# Altium schematic sheet FPGA2.SchDoc: FPGA2
size A; Revision: 04
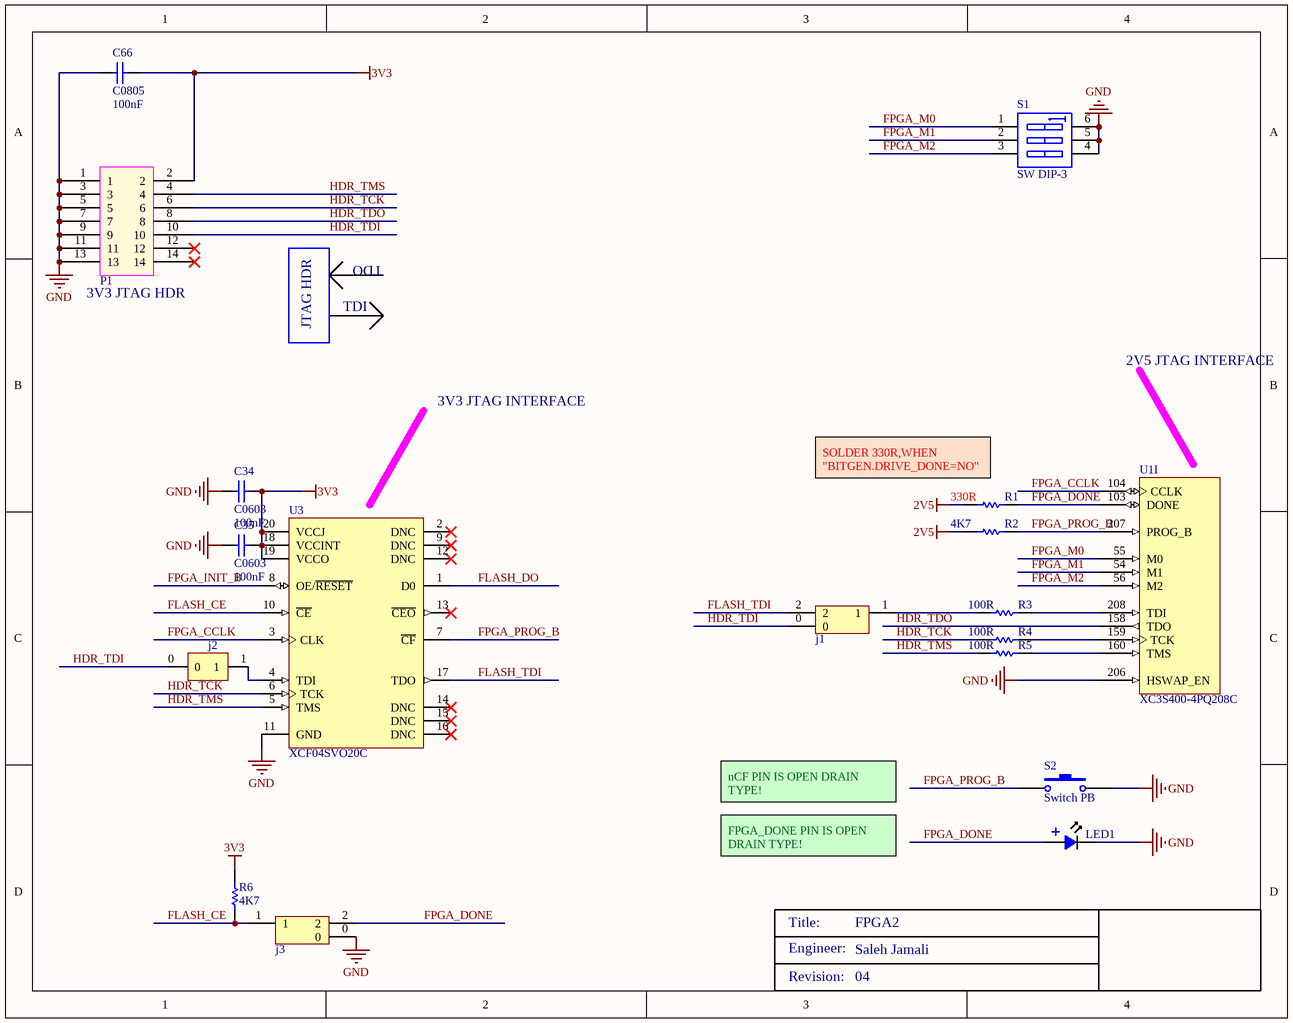
[diagram p0: FPGA2.SchDoc]

## Parts
C34  C0603  value 100nF  [0603]
C35  C0603  value 100nF  [0603]
C66  C0805  value 100nF  [0805]
j1  3pin  [3PIN]  (value not drawn)
j2  2pin  [2PIN]  (value not drawn)
j3  3pin  [3PIN]  (value not drawn)
LED1  LED_SMD  [LED_805]  (value not drawn)
P1  BoxHeader_14  [14p]  (value not drawn)
R1  330R  [ERA-0805]
R2  4K7  [ERA-0805]
R3  100R  [ERA-0805]
R4  100R  [ERA-0805]
R5  100R  [ERA-0805]
R6  4K7  [ERA-0805]
S1  SW DIP-3  [DIP-6]
S2  Switch PB  [Switch - Push to On]
U1  XC3S400-4PQ208C  [PQ208_N]  (part I of 11)
U3  XCF04SVO20C  [VO20_N]

## Nets
2V5: R1.1 R2.1
3V3: C34.1 C35.1 C66.2 P1.2 R6.2 U3.18(VCCINT) U3.19(VCCO) U3.20(VCCJ)
GND: C34.2 C35.2 C66.1 j3.0 LED1.2 P1.1 P1.3 P1.5 P1.7 P1.9 P1.11 P1.13 S1.4(B3) S1.5(B2) S1.6(B1) S2.2 U1.206(HSWAP_EN) U3.11(GND)
FLASH_CE: j3.1 R6.1 U3.10(~{CE})
FLASH_DO: U3.1(D0)
FLASH_TDI: j1.2 U3.17(TDO)
FPGA_CCLK: U1.104(CCLK) U3.3(CLK)
FPGA_DONE: j3.2 LED1.1 R1.2 U1.103(DONE)
FPGA_INIT_B: U3.8(OE/~{RESET})
FPGA_M0: S1.1(A1) U1.55(M0)
FPGA_M1: S1.2(A2) U1.54(M1)
FPGA_M2: S1.3(A3) U1.56(M2)
FPGA_PROG_B: R2.2 S2.1 U1.207(PROG_B) U3.7(~{CF})
HDR_TCK: P1.6 R4.1 U3.6(TCK)
HDR_TDI: j1.0 j2.0 P1.10
HDR_TDO: P1.8 U1.158(TDO)
HDR_TMS: P1.4 R5.1 U3.5(TMS)
Netj1_1: j1.1 R3.1
Netj2_1: j2.1 U3.4(TDI)
NetR3_2: R3.2 U1.208(TDI)
NetR4_2: R4.2 U1.159(TCK)
NetR5_2: R5.2 U1.160(TMS)

Not connected (* = marked no-connect by the designer): P1 12* 14*; U3 2(DNC)* 9(DNC)* 12(DNC)* 13(~{CEO})* 14(DNC)* 15(DNC)* 16(DNC)*

## Notes on the sheet
- (near P1) 3V3 JTAG HDR
- TDO
- JTAG HDR
- TDI
- 2V5 JTAG INTERFACE
- 3V3 JTAG INTERFACE
- (near R1) SOLDER 330R,WHEN "BITGEN.DRIVE_DONE=NO"
- (near U1) if HSWAP=GND then
  {
  pullup resistors Enabled
  }
- nCF PIN IS OPEN DRAIN TYPE!
- FPGA_DONE PIN IS OPEN DRAIN TYPE!
- Engineer:
- Title:
- Saleh Jamali
- Revision:

## Library data of the parts
C34 C35 = C0603: Ceramic Chip Capacitor - Standard; Note: Footprint corresponds to dimensions for bulk cassette packaging. This case size has tightened tolerances.; Published: 17-Jul-2002; LatestRevisionDate: 19-Mar-2004; LatestRevisionNote: Silkscreen size reduced.; DatasheetDocument: Mar-2001; PackageDocument: Mar-2001; PackageReference: 0603; Publisher: Altium Limited; Code_JEITA: 0603; Code_IPC: 1608 [0603]; ComponentLink1Description: Manufacturer Link; ComponentLink1URL: http://www.kemet.com/; ComponentLink2Description: Datasheet; ComponentLink2URL: http://www.kemet.com/kemet/web/homepage/kechome.nsf/vapubfilesname/F3102TA.pdf/$file/F3102TA.pdf
C66 = C0805: Ceramic Chip Capacitor - Standard; Note: Footprint corresponds to dimensions for bulk cassette packaging. This case size has tightened tolerances.; Published: 17-Jul-2002; LatestRevisionDate: 19-Mar-2004; LatestRevisionNote: Silkscreen size reduced.; DatasheetDocument: Mar-2001; PackageDocument: Mar-2001; PackageReference: 0805; Publisher: Altium Limited; Code_JEITA: 0805; Code_IPC: 2012[0805]; ComponentLink1Description: Manufacturer Link; ComponentLink1URL: http://www.kemet.com/; ComponentLink2Description: Datasheet; ComponentLink2URL: http://www.kemet.com/kemet/web/homepage/kechome.nsf/vapubfilesname/F3102TA.pdf/$file/F3102TA.pdf
R1-R6 = ERA6Y: Rectangular Thick Film Chip Resistor, 10 Ohm to 1M Ohm Range, 0.1% and 0.5% Tolerance, 0805 Size, 0.1 W; Note: If flow soldering, adjust pad width of PCB Footprint to 0.7 - 0.8 times the width of the resistor.; Published: 17-Dec-2003; LatestRevisionDate: 19-Mar-2004; LatestRevisionNote: Silkscreen size reduced.; PackageDocument: Mar-2003; PackageReference: ERA-0805; Publisher: Altium Limited; Code_IPC: 2012 [0805]; ComponentLink1Description: Manufacturer Link; ComponentLink1URL: http://www.panasonic.com/industrial/components/resistive_products.htm; ComponentLink2Description: Datasheet; ComponentLink2URL: http://www.panasonic.com/industrial/components/pdf/AOA0000CE8.pdf
S1 = SW DIP-3: DIP Switch, 3 Position, SPST; Published: 24-Mar-1999; LatestRevisionDate: 17-Jul-2002; LatestRevisionNote: Re-released for DXP Platform.; PackageReference: DIP-6; Publisher: Altium Limited; Code_JEDEC: MO-001-AM
S2 = Switch PB: Push Button Switch
U1 = XC3S400-4PQ208C: Spartan-3 1.2V FPGA, 141 User I/Os, 208-Pin PQFP, Standard Performance, Commercial Grade; OrderingInformation: Additional code may have to be appended for different mask revision devices.; DatasheetVersion: ver2.5, Dec-2009; PackageVersion: ver1.2, Jun-2004; PackageReference: PQ208; PackageDescription: 208-Pin Plastic Quad Flat Pack (PQ208); Code_JEDEC: MS-029-FA-1; ComponentLink1Description: Manufacturer URL; ComponentLink1URL: http://www.xilinx.com/; ComponentLink2Description: Spartan-3 Datasheet; ComponentLink2URL: http://www.xilinx.com/support/documentation/data_sheets/ds099.pdf; ComponentLink3Description: PQ208 Package Drawing; ComponentLink3URL: http://www.xilinx.com/support/documentation/package_specs/pq208.pdf; ComponentLink4Description: Spartan-3 Documents; ComponentLink4URL: http://www.xilinx.com/support/documentation/spartan-3.htm
U3 = XCF04SVO20C: XCF00S Series, Platform Flash In-System Programmable Configuration 3.3V PROM, 20-Pin TSOP, 4-Megabit, Commercial Grade; DatasheetVersion: ver2.17, Oct-2009; PackageVersion: ver1.3, Dec-2008; PackageReference: VO20; PackageDescription: 20-Pin Thin Shrink Small Outline Package (VO20); Code_JEDEC: MO-153-AC; ComponentLink1Description: Manufacturer URL; ComponentLink1URL: http://www.xilinx.com/; ComponentLink2Description: Platform Flash Datasheet; ComponentLink2URL: http://www.xilinx.com/support/documentation/data_sheets/ds123.pdf; ComponentLink3Description: VO20 Package Drawing; ComponentLink3URL: http://www.xilinx.com/support/documentation/package_specs/vo20.pdf; ComponentLink4Description: Configuration PROM Documents; ComponentLink4URL: http://www.xilinx.com/support/documentation/configuration_proms.htm